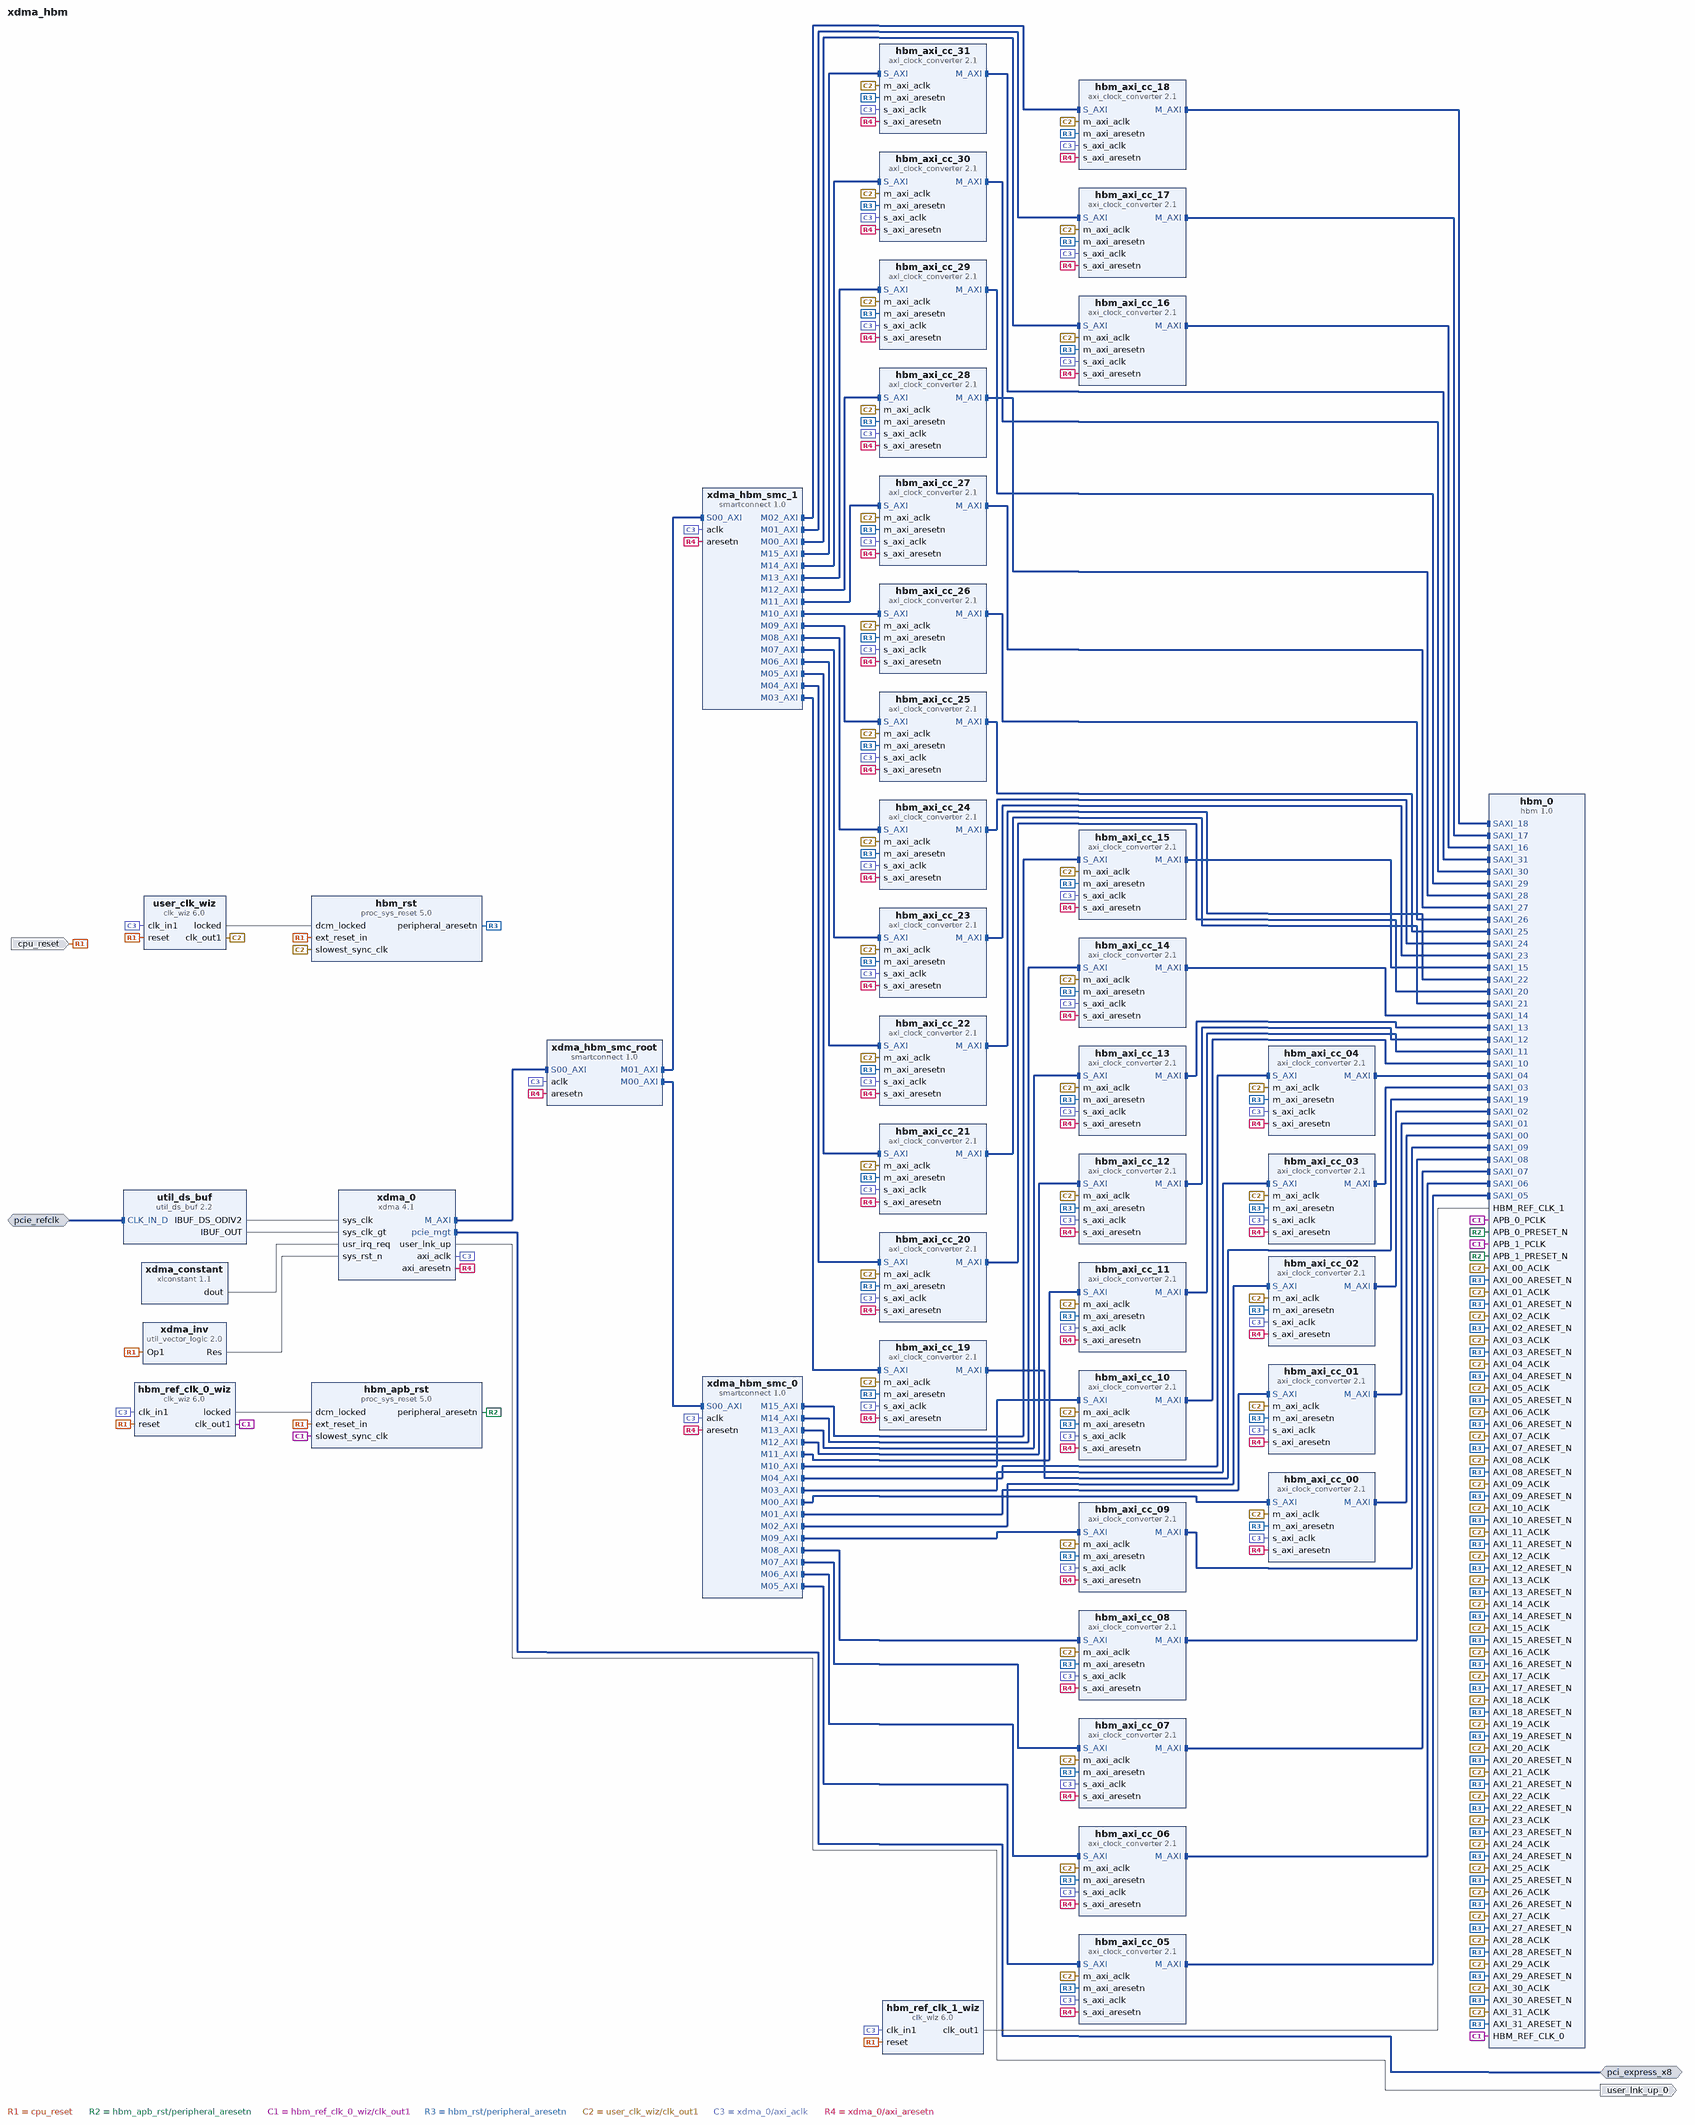
[diagram p0: block diagram of the top level]
# Vivado block design xdma_hbm, xcvu37p-fsvh2892-2L-e, Vivado 2024.2.2
create_bd_design xdma_hbm

create_bd_intf_port -mode Master -vlnv xilinx.com:interface:pcie_7x_mgt_rtl:1.0 pci_express_x8
create_bd_intf_port -mode Slave -vlnv xilinx.com:interface:diff_clock_rtl:1.0 pcie_refclk
set_property -dict {CONFIG.FREQ_HZ 100000000} [get_bd_intf_ports pcie_refclk]
create_bd_port -dir O user_lnk_up_0
create_bd_port -dir I -type rst cpu_reset
set_property -dict {CONFIG.POLARITY ACTIVE_HIGH} [get_bd_ports cpu_reset]

create_bd_cell -type ip -vlnv xilinx.com:ip:xdma:4.1 xdma_0
set_property -dict [list \
  CONFIG.PCIE_BOARD_INTERFACE pci_express_x8 \
  CONFIG.axi_data_width 256_bit \
  CONFIG.axilite_master_en false \
  CONFIG.axisten_freq 250 \
  CONFIG.cfg_mgmt_if false \
  CONFIG.en_ext_ch_gt_drp false \
  CONFIG.en_pcie_drp false \
  CONFIG.en_transceiver_status_ports false \
  CONFIG.enable_jtag_dbg false \
  CONFIG.mode_selection Advanced \
  CONFIG.pcie_extended_tag true \
  CONFIG.pf0_device_id 9024 \
  CONFIG.pf0_interrupt_pin NONE \
  CONFIG.pf0_msix_cap_pba_bir BAR_1:0 \
  CONFIG.pf0_msix_cap_pba_offset 00008FE0 \
  CONFIG.pf0_msix_cap_table_bir BAR_1:0 \
  CONFIG.pf0_msix_cap_table_offset 00008000 \
  CONFIG.pf0_msix_cap_table_size 01F \
  CONFIG.pf0_msix_enabled true \
  CONFIG.pipe_sim false \
  CONFIG.pl_link_cap_max_link_speed 8.0_GT/s \
  CONFIG.plltype QPLL1 \
  CONFIG.xdma_axi_intf_mm AXI_Memory_Mapped \
  CONFIG.xdma_pcie_64bit_en true \
  CONFIG.xdma_rnum_chnl 4 \
  CONFIG.xdma_wnum_chnl 4 \
] [get_bd_cells xdma_0]
create_bd_cell -type ip -vlnv xilinx.com:ip:xlconstant:1.1 xdma_constant
set_property -dict {CONFIG.CONST_VAL 0} [get_bd_cells xdma_constant]
create_bd_cell -type ip -vlnv xilinx.com:ip:util_vector_logic:2.0 xdma_inv
set_property -dict {CONFIG.C_OPERATION not CONFIG.C_SIZE 1} [get_bd_cells xdma_inv]
create_bd_cell -type ip -vlnv xilinx.com:ip:hbm:1.0 hbm_0
set_property -dict [list \
  CONFIG.USER_APB_EN false \
  CONFIG.USER_AXI_CLK1_FREQ 450 \
  CONFIG.USER_AXI_CLK_FREQ 450 \
  CONFIG.USER_HBM_DENSITY 8GB \
  CONFIG.USER_HBM_STACK 2 \
  CONFIG.USER_MC_ENABLE_00 TRUE \
  CONFIG.USER_MC_ENABLE_01 TRUE \
  CONFIG.USER_MC_ENABLE_02 TRUE \
  CONFIG.USER_MC_ENABLE_03 TRUE \
  CONFIG.USER_MC_ENABLE_04 TRUE \
  CONFIG.USER_MC_ENABLE_05 TRUE \
  CONFIG.USER_MC_ENABLE_06 TRUE \
  CONFIG.USER_MC_ENABLE_07 TRUE \
  CONFIG.USER_MC_ENABLE_08 TRUE \
  CONFIG.USER_MC_ENABLE_09 TRUE \
  CONFIG.USER_MC_ENABLE_10 TRUE \
  CONFIG.USER_MC_ENABLE_11 TRUE \
  CONFIG.USER_MC_ENABLE_12 TRUE \
  CONFIG.USER_MC_ENABLE_13 TRUE \
  CONFIG.USER_MC_ENABLE_14 TRUE \
  CONFIG.USER_MC_ENABLE_15 TRUE \
  CONFIG.USER_MC_ENABLE_APB_00 FALSE \
  CONFIG.USER_MC_ENABLE_APB_01 FALSE \
  CONFIG.USER_PHY_ENABLE_00 TRUE \
  CONFIG.USER_PHY_ENABLE_01 TRUE \
  CONFIG.USER_PHY_ENABLE_02 TRUE \
  CONFIG.USER_PHY_ENABLE_03 TRUE \
  CONFIG.USER_PHY_ENABLE_04 TRUE \
  CONFIG.USER_PHY_ENABLE_05 TRUE \
  CONFIG.USER_PHY_ENABLE_06 TRUE \
  CONFIG.USER_PHY_ENABLE_07 TRUE \
  CONFIG.USER_PHY_ENABLE_08 TRUE \
  CONFIG.USER_PHY_ENABLE_09 TRUE \
  CONFIG.USER_PHY_ENABLE_10 TRUE \
  CONFIG.USER_PHY_ENABLE_11 TRUE \
  CONFIG.USER_PHY_ENABLE_12 TRUE \
  CONFIG.USER_PHY_ENABLE_13 TRUE \
  CONFIG.USER_PHY_ENABLE_14 TRUE \
  CONFIG.USER_PHY_ENABLE_15 TRUE \
  CONFIG.USER_SAXI_00 true \
  CONFIG.USER_SAXI_01 true \
  CONFIG.USER_SAXI_02 true \
  CONFIG.USER_SAXI_03 true \
  CONFIG.USER_SAXI_04 true \
  CONFIG.USER_SAXI_05 true \
  CONFIG.USER_SAXI_06 true \
  CONFIG.USER_SAXI_07 true \
  CONFIG.USER_SAXI_08 true \
  CONFIG.USER_SAXI_09 true \
  CONFIG.USER_SAXI_10 true \
  CONFIG.USER_SAXI_11 true \
  CONFIG.USER_SAXI_12 true \
  CONFIG.USER_SAXI_13 true \
  CONFIG.USER_SAXI_14 true \
  CONFIG.USER_SAXI_15 true \
  CONFIG.USER_SAXI_16 true \
  CONFIG.USER_SAXI_17 true \
  CONFIG.USER_SAXI_18 true \
  CONFIG.USER_SAXI_19 true \
  CONFIG.USER_SAXI_20 true \
  CONFIG.USER_SAXI_21 true \
  CONFIG.USER_SAXI_22 true \
  CONFIG.USER_SAXI_23 true \
  CONFIG.USER_SAXI_24 true \
  CONFIG.USER_SAXI_25 true \
  CONFIG.USER_SAXI_26 true \
  CONFIG.USER_SAXI_27 true \
  CONFIG.USER_SAXI_28 true \
  CONFIG.USER_SAXI_29 true \
  CONFIG.USER_SAXI_30 true \
  CONFIG.USER_SAXI_31 true \
  CONFIG.USER_SWITCH_ENABLE_00 FALSE \
  CONFIG.USER_SWITCH_ENABLE_01 FALSE \
] [get_bd_cells hbm_0]
create_bd_cell -type ip -vlnv xilinx.com:ip:clk_wiz:6.0 hbm_ref_clk_0_wiz
set_property -dict [list \
  CONFIG.CLKOUT1_REQUESTED_OUT_FREQ 100.000 \
  CONFIG.OPTIMIZE_CLOCKING_STRUCTURE_EN true \
  CONFIG.PRIM_IN_FREQ 250.000 \
  CONFIG.RESET_TYPE ACTIVE_HIGH \
] [get_bd_cells hbm_ref_clk_0_wiz]
create_bd_cell -type ip -vlnv xilinx.com:ip:clk_wiz:6.0 hbm_ref_clk_1_wiz
set_property -dict [list \
  CONFIG.CLKOUT1_REQUESTED_OUT_FREQ 100.000 \
  CONFIG.OPTIMIZE_CLOCKING_STRUCTURE_EN true \
  CONFIG.PRIM_IN_FREQ 250.000 \
  CONFIG.RESET_TYPE ACTIVE_HIGH \
] [get_bd_cells hbm_ref_clk_1_wiz]
create_bd_cell -type ip -vlnv xilinx.com:ip:clk_wiz:6.0 user_clk_wiz
set_property -dict [list \
  CONFIG.CLKOUT1_REQUESTED_OUT_FREQ 450.000 \
  CONFIG.OPTIMIZE_CLOCKING_STRUCTURE_EN true \
  CONFIG.PRIM_IN_FREQ 250.000 \
  CONFIG.RESET_TYPE ACTIVE_HIGH \
] [get_bd_cells user_clk_wiz]
create_bd_cell -type ip -vlnv xilinx.com:ip:proc_sys_reset:5.0 hbm_rst
create_bd_cell -type ip -vlnv xilinx.com:ip:proc_sys_reset:5.0 hbm_apb_rst
create_bd_cell -type ip -vlnv xilinx.com:ip:axi_clock_converter:2.1 hbm_axi_cc_00
create_bd_cell -type ip -vlnv xilinx.com:ip:axi_clock_converter:2.1 hbm_axi_cc_01
create_bd_cell -type ip -vlnv xilinx.com:ip:axi_clock_converter:2.1 hbm_axi_cc_02
create_bd_cell -type ip -vlnv xilinx.com:ip:axi_clock_converter:2.1 hbm_axi_cc_03
create_bd_cell -type ip -vlnv xilinx.com:ip:axi_clock_converter:2.1 hbm_axi_cc_04
create_bd_cell -type ip -vlnv xilinx.com:ip:axi_clock_converter:2.1 hbm_axi_cc_05
create_bd_cell -type ip -vlnv xilinx.com:ip:axi_clock_converter:2.1 hbm_axi_cc_06
create_bd_cell -type ip -vlnv xilinx.com:ip:axi_clock_converter:2.1 hbm_axi_cc_07
create_bd_cell -type ip -vlnv xilinx.com:ip:axi_clock_converter:2.1 hbm_axi_cc_08
create_bd_cell -type ip -vlnv xilinx.com:ip:axi_clock_converter:2.1 hbm_axi_cc_09
create_bd_cell -type ip -vlnv xilinx.com:ip:axi_clock_converter:2.1 hbm_axi_cc_10
create_bd_cell -type ip -vlnv xilinx.com:ip:axi_clock_converter:2.1 hbm_axi_cc_11
create_bd_cell -type ip -vlnv xilinx.com:ip:axi_clock_converter:2.1 hbm_axi_cc_12
create_bd_cell -type ip -vlnv xilinx.com:ip:axi_clock_converter:2.1 hbm_axi_cc_13
create_bd_cell -type ip -vlnv xilinx.com:ip:axi_clock_converter:2.1 hbm_axi_cc_14
create_bd_cell -type ip -vlnv xilinx.com:ip:axi_clock_converter:2.1 hbm_axi_cc_15
create_bd_cell -type ip -vlnv xilinx.com:ip:axi_clock_converter:2.1 hbm_axi_cc_16
create_bd_cell -type ip -vlnv xilinx.com:ip:axi_clock_converter:2.1 hbm_axi_cc_17
create_bd_cell -type ip -vlnv xilinx.com:ip:axi_clock_converter:2.1 hbm_axi_cc_18
create_bd_cell -type ip -vlnv xilinx.com:ip:axi_clock_converter:2.1 hbm_axi_cc_19
create_bd_cell -type ip -vlnv xilinx.com:ip:axi_clock_converter:2.1 hbm_axi_cc_20
create_bd_cell -type ip -vlnv xilinx.com:ip:axi_clock_converter:2.1 hbm_axi_cc_21
create_bd_cell -type ip -vlnv xilinx.com:ip:axi_clock_converter:2.1 hbm_axi_cc_22
create_bd_cell -type ip -vlnv xilinx.com:ip:axi_clock_converter:2.1 hbm_axi_cc_23
create_bd_cell -type ip -vlnv xilinx.com:ip:axi_clock_converter:2.1 hbm_axi_cc_24
create_bd_cell -type ip -vlnv xilinx.com:ip:axi_clock_converter:2.1 hbm_axi_cc_25
create_bd_cell -type ip -vlnv xilinx.com:ip:axi_clock_converter:2.1 hbm_axi_cc_26
create_bd_cell -type ip -vlnv xilinx.com:ip:axi_clock_converter:2.1 hbm_axi_cc_27
create_bd_cell -type ip -vlnv xilinx.com:ip:axi_clock_converter:2.1 hbm_axi_cc_28
create_bd_cell -type ip -vlnv xilinx.com:ip:axi_clock_converter:2.1 hbm_axi_cc_29
create_bd_cell -type ip -vlnv xilinx.com:ip:axi_clock_converter:2.1 hbm_axi_cc_30
create_bd_cell -type ip -vlnv xilinx.com:ip:axi_clock_converter:2.1 hbm_axi_cc_31
create_bd_cell -type ip -vlnv xilinx.com:ip:smartconnect:1.0 xdma_hbm_smc_root
set_property -dict {CONFIG.NUM_MI 2 CONFIG.NUM_SI 1} [get_bd_cells xdma_hbm_smc_root]
create_bd_cell -type ip -vlnv xilinx.com:ip:smartconnect:1.0 xdma_hbm_smc_0
set_property -dict {CONFIG.NUM_MI 16 CONFIG.NUM_SI 1} [get_bd_cells xdma_hbm_smc_0]
create_bd_cell -type ip -vlnv xilinx.com:ip:smartconnect:1.0 xdma_hbm_smc_1
set_property -dict {CONFIG.NUM_MI 16 CONFIG.NUM_SI 1} [get_bd_cells xdma_hbm_smc_1]
create_bd_cell -type ip -vlnv xilinx.com:ip:util_ds_buf:2.2 util_ds_buf
set_property -dict {CONFIG.DIFF_CLK_IN_BOARD_INTERFACE pcie_refclk CONFIG.USE_BOARD_FLOW true} [get_bd_cells util_ds_buf]

# ---- connections ----

connect_bd_intf_net [get_bd_intf_pins hbm_axi_cc_00/M_AXI] [get_bd_intf_pins hbm_0/SAXI_00]
connect_bd_intf_net [get_bd_intf_pins hbm_axi_cc_01/M_AXI] [get_bd_intf_pins hbm_0/SAXI_01]
connect_bd_intf_net [get_bd_intf_pins hbm_axi_cc_02/M_AXI] [get_bd_intf_pins hbm_0/SAXI_02]
connect_bd_intf_net [get_bd_intf_pins hbm_axi_cc_03/M_AXI] [get_bd_intf_pins hbm_0/SAXI_03]
connect_bd_intf_net [get_bd_intf_pins hbm_axi_cc_04/M_AXI] [get_bd_intf_pins hbm_0/SAXI_04]
connect_bd_intf_net [get_bd_intf_pins hbm_axi_cc_05/M_AXI] [get_bd_intf_pins hbm_0/SAXI_05]
connect_bd_intf_net [get_bd_intf_pins hbm_axi_cc_06/M_AXI] [get_bd_intf_pins hbm_0/SAXI_06]
connect_bd_intf_net [get_bd_intf_pins hbm_axi_cc_07/M_AXI] [get_bd_intf_pins hbm_0/SAXI_07]
connect_bd_intf_net [get_bd_intf_pins hbm_axi_cc_08/M_AXI] [get_bd_intf_pins hbm_0/SAXI_08]
connect_bd_intf_net [get_bd_intf_pins hbm_axi_cc_09/M_AXI] [get_bd_intf_pins hbm_0/SAXI_09]
connect_bd_intf_net [get_bd_intf_pins hbm_axi_cc_10/M_AXI] [get_bd_intf_pins hbm_0/SAXI_10]
connect_bd_intf_net [get_bd_intf_pins hbm_axi_cc_11/M_AXI] [get_bd_intf_pins hbm_0/SAXI_11]
connect_bd_intf_net [get_bd_intf_pins hbm_axi_cc_12/M_AXI] [get_bd_intf_pins hbm_0/SAXI_12]
connect_bd_intf_net [get_bd_intf_pins hbm_axi_cc_13/M_AXI] [get_bd_intf_pins hbm_0/SAXI_13]
connect_bd_intf_net [get_bd_intf_pins hbm_axi_cc_14/M_AXI] [get_bd_intf_pins hbm_0/SAXI_14]
connect_bd_intf_net [get_bd_intf_pins hbm_axi_cc_15/M_AXI] [get_bd_intf_pins hbm_0/SAXI_15]
connect_bd_intf_net [get_bd_intf_pins hbm_axi_cc_16/M_AXI] [get_bd_intf_pins hbm_0/SAXI_16]
connect_bd_intf_net [get_bd_intf_pins hbm_axi_cc_17/M_AXI] [get_bd_intf_pins hbm_0/SAXI_17]
connect_bd_intf_net [get_bd_intf_pins hbm_axi_cc_18/M_AXI] [get_bd_intf_pins hbm_0/SAXI_18]
connect_bd_intf_net [get_bd_intf_pins hbm_axi_cc_19/M_AXI] [get_bd_intf_pins hbm_0/SAXI_19]
connect_bd_intf_net [get_bd_intf_pins hbm_axi_cc_20/M_AXI] [get_bd_intf_pins hbm_0/SAXI_20]
connect_bd_intf_net [get_bd_intf_pins hbm_axi_cc_21/M_AXI] [get_bd_intf_pins hbm_0/SAXI_21]
connect_bd_intf_net [get_bd_intf_pins hbm_axi_cc_22/M_AXI] [get_bd_intf_pins hbm_0/SAXI_22]
connect_bd_intf_net [get_bd_intf_pins hbm_axi_cc_23/M_AXI] [get_bd_intf_pins hbm_0/SAXI_23]
connect_bd_intf_net [get_bd_intf_pins hbm_axi_cc_24/M_AXI] [get_bd_intf_pins hbm_0/SAXI_24]
connect_bd_intf_net [get_bd_intf_pins hbm_axi_cc_25/M_AXI] [get_bd_intf_pins hbm_0/SAXI_25]
connect_bd_intf_net [get_bd_intf_pins hbm_axi_cc_26/M_AXI] [get_bd_intf_pins hbm_0/SAXI_26]
connect_bd_intf_net [get_bd_intf_pins hbm_axi_cc_27/M_AXI] [get_bd_intf_pins hbm_0/SAXI_27]
connect_bd_intf_net [get_bd_intf_pins hbm_axi_cc_28/M_AXI] [get_bd_intf_pins hbm_0/SAXI_28]
connect_bd_intf_net [get_bd_intf_pins hbm_axi_cc_29/M_AXI] [get_bd_intf_pins hbm_0/SAXI_29]
connect_bd_intf_net [get_bd_intf_pins hbm_axi_cc_30/M_AXI] [get_bd_intf_pins hbm_0/SAXI_30]
connect_bd_intf_net [get_bd_intf_pins hbm_axi_cc_31/M_AXI] [get_bd_intf_pins hbm_0/SAXI_31]
connect_bd_intf_net [get_bd_intf_ports pcie_refclk] [get_bd_intf_pins util_ds_buf/CLK_IN_D]
connect_bd_intf_net [get_bd_intf_pins xdma_0/M_AXI] [get_bd_intf_pins xdma_hbm_smc_root/S00_AXI]
connect_bd_intf_net [get_bd_intf_ports pci_express_x8] [get_bd_intf_pins xdma_0/pcie_mgt]
connect_bd_intf_net [get_bd_intf_pins xdma_hbm_smc_0/M00_AXI] [get_bd_intf_pins hbm_axi_cc_00/S_AXI]
connect_bd_intf_net [get_bd_intf_pins xdma_hbm_smc_0/M01_AXI] [get_bd_intf_pins hbm_axi_cc_01/S_AXI]
connect_bd_intf_net [get_bd_intf_pins xdma_hbm_smc_0/M02_AXI] [get_bd_intf_pins hbm_axi_cc_02/S_AXI]
connect_bd_intf_net [get_bd_intf_pins xdma_hbm_smc_0/M03_AXI] [get_bd_intf_pins hbm_axi_cc_03/S_AXI]
connect_bd_intf_net [get_bd_intf_pins xdma_hbm_smc_0/M04_AXI] [get_bd_intf_pins hbm_axi_cc_04/S_AXI]
connect_bd_intf_net [get_bd_intf_pins xdma_hbm_smc_0/M05_AXI] [get_bd_intf_pins hbm_axi_cc_05/S_AXI]
connect_bd_intf_net [get_bd_intf_pins xdma_hbm_smc_0/M06_AXI] [get_bd_intf_pins hbm_axi_cc_06/S_AXI]
connect_bd_intf_net [get_bd_intf_pins xdma_hbm_smc_0/M07_AXI] [get_bd_intf_pins hbm_axi_cc_07/S_AXI]
connect_bd_intf_net [get_bd_intf_pins xdma_hbm_smc_0/M08_AXI] [get_bd_intf_pins hbm_axi_cc_08/S_AXI]
connect_bd_intf_net [get_bd_intf_pins xdma_hbm_smc_0/M09_AXI] [get_bd_intf_pins hbm_axi_cc_09/S_AXI]
connect_bd_intf_net [get_bd_intf_pins xdma_hbm_smc_0/M10_AXI] [get_bd_intf_pins hbm_axi_cc_10/S_AXI]
connect_bd_intf_net [get_bd_intf_pins xdma_hbm_smc_0/M11_AXI] [get_bd_intf_pins hbm_axi_cc_11/S_AXI]
connect_bd_intf_net [get_bd_intf_pins xdma_hbm_smc_0/M12_AXI] [get_bd_intf_pins hbm_axi_cc_12/S_AXI]
connect_bd_intf_net [get_bd_intf_pins xdma_hbm_smc_0/M13_AXI] [get_bd_intf_pins hbm_axi_cc_13/S_AXI]
connect_bd_intf_net [get_bd_intf_pins xdma_hbm_smc_0/M14_AXI] [get_bd_intf_pins hbm_axi_cc_14/S_AXI]
connect_bd_intf_net [get_bd_intf_pins xdma_hbm_smc_0/M15_AXI] [get_bd_intf_pins hbm_axi_cc_15/S_AXI]
connect_bd_intf_net [get_bd_intf_pins xdma_hbm_smc_1/M00_AXI] [get_bd_intf_pins hbm_axi_cc_16/S_AXI]
connect_bd_intf_net [get_bd_intf_pins xdma_hbm_smc_1/M01_AXI] [get_bd_intf_pins hbm_axi_cc_17/S_AXI]
connect_bd_intf_net [get_bd_intf_pins xdma_hbm_smc_1/M02_AXI] [get_bd_intf_pins hbm_axi_cc_18/S_AXI]
connect_bd_intf_net [get_bd_intf_pins xdma_hbm_smc_1/M03_AXI] [get_bd_intf_pins hbm_axi_cc_19/S_AXI]
connect_bd_intf_net [get_bd_intf_pins xdma_hbm_smc_1/M04_AXI] [get_bd_intf_pins hbm_axi_cc_20/S_AXI]
connect_bd_intf_net [get_bd_intf_pins xdma_hbm_smc_1/M05_AXI] [get_bd_intf_pins hbm_axi_cc_21/S_AXI]
connect_bd_intf_net [get_bd_intf_pins xdma_hbm_smc_1/M06_AXI] [get_bd_intf_pins hbm_axi_cc_22/S_AXI]
connect_bd_intf_net [get_bd_intf_pins xdma_hbm_smc_1/M07_AXI] [get_bd_intf_pins hbm_axi_cc_23/S_AXI]
connect_bd_intf_net [get_bd_intf_pins xdma_hbm_smc_1/M08_AXI] [get_bd_intf_pins hbm_axi_cc_24/S_AXI]
connect_bd_intf_net [get_bd_intf_pins xdma_hbm_smc_1/M09_AXI] [get_bd_intf_pins hbm_axi_cc_25/S_AXI]
connect_bd_intf_net [get_bd_intf_pins xdma_hbm_smc_1/M10_AXI] [get_bd_intf_pins hbm_axi_cc_26/S_AXI]
connect_bd_intf_net [get_bd_intf_pins xdma_hbm_smc_1/M11_AXI] [get_bd_intf_pins hbm_axi_cc_27/S_AXI]
connect_bd_intf_net [get_bd_intf_pins xdma_hbm_smc_1/M12_AXI] [get_bd_intf_pins hbm_axi_cc_28/S_AXI]
connect_bd_intf_net [get_bd_intf_pins xdma_hbm_smc_1/M13_AXI] [get_bd_intf_pins hbm_axi_cc_29/S_AXI]
connect_bd_intf_net [get_bd_intf_pins xdma_hbm_smc_1/M14_AXI] [get_bd_intf_pins hbm_axi_cc_30/S_AXI]
connect_bd_intf_net [get_bd_intf_pins xdma_hbm_smc_1/M15_AXI] [get_bd_intf_pins hbm_axi_cc_31/S_AXI]
connect_bd_intf_net [get_bd_intf_pins xdma_hbm_smc_root/M00_AXI] [get_bd_intf_pins xdma_hbm_smc_0/S00_AXI]
connect_bd_intf_net [get_bd_intf_pins xdma_hbm_smc_root/M01_AXI] [get_bd_intf_pins xdma_hbm_smc_1/S00_AXI]
connect_bd_net [get_bd_ports cpu_reset] \
  [get_bd_pins xdma_inv/Op1] [get_bd_pins hbm_ref_clk_0_wiz/reset] [get_bd_pins hbm_ref_clk_1_wiz/reset] \
  [get_bd_pins user_clk_wiz/reset] [get_bd_pins hbm_rst/ext_reset_in] [get_bd_pins hbm_apb_rst/ext_reset_in]
connect_bd_net [get_bd_pins hbm_apb_rst/peripheral_aresetn] [get_bd_pins hbm_0/APB_0_PRESET_N] [get_bd_pins hbm_0/APB_1_PRESET_N]
connect_bd_net [get_bd_pins hbm_ref_clk_0_wiz/clk_out1] \
  [get_bd_pins hbm_apb_rst/slowest_sync_clk] [get_bd_pins hbm_0/HBM_REF_CLK_0] [get_bd_pins hbm_0/APB_0_PCLK] \
  [get_bd_pins hbm_0/APB_1_PCLK]
connect_bd_net [get_bd_pins hbm_ref_clk_0_wiz/locked] [get_bd_pins hbm_apb_rst/dcm_locked]
connect_bd_net [get_bd_pins hbm_ref_clk_1_wiz/clk_out1] [get_bd_pins hbm_0/HBM_REF_CLK_1]
connect_bd_net [get_bd_pins hbm_rst/peripheral_aresetn] \
  [get_bd_pins hbm_axi_cc_00/m_axi_aresetn] [get_bd_pins hbm_0/AXI_00_ARESET_N] [get_bd_pins hbm_axi_cc_01/m_axi_aresetn] \
  [get_bd_pins hbm_0/AXI_01_ARESET_N] [get_bd_pins hbm_axi_cc_02/m_axi_aresetn] [get_bd_pins hbm_0/AXI_02_ARESET_N] \
  [get_bd_pins hbm_axi_cc_03/m_axi_aresetn] [get_bd_pins hbm_0/AXI_03_ARESET_N] [get_bd_pins hbm_axi_cc_04/m_axi_aresetn] \
  [get_bd_pins hbm_0/AXI_04_ARESET_N] [get_bd_pins hbm_axi_cc_05/m_axi_aresetn] [get_bd_pins hbm_0/AXI_05_ARESET_N] \
  [get_bd_pins hbm_axi_cc_06/m_axi_aresetn] [get_bd_pins hbm_0/AXI_06_ARESET_N] [get_bd_pins hbm_axi_cc_07/m_axi_aresetn] \
  [get_bd_pins hbm_0/AXI_07_ARESET_N] [get_bd_pins hbm_axi_cc_08/m_axi_aresetn] [get_bd_pins hbm_0/AXI_08_ARESET_N] \
  [get_bd_pins hbm_axi_cc_09/m_axi_aresetn] [get_bd_pins hbm_0/AXI_09_ARESET_N] [get_bd_pins hbm_axi_cc_10/m_axi_aresetn] \
  [get_bd_pins hbm_0/AXI_10_ARESET_N] [get_bd_pins hbm_axi_cc_11/m_axi_aresetn] [get_bd_pins hbm_0/AXI_11_ARESET_N] \
  [get_bd_pins hbm_axi_cc_12/m_axi_aresetn] [get_bd_pins hbm_0/AXI_12_ARESET_N] [get_bd_pins hbm_axi_cc_13/m_axi_aresetn] \
  [get_bd_pins hbm_0/AXI_13_ARESET_N] [get_bd_pins hbm_axi_cc_14/m_axi_aresetn] [get_bd_pins hbm_0/AXI_14_ARESET_N] \
  [get_bd_pins hbm_axi_cc_15/m_axi_aresetn] [get_bd_pins hbm_0/AXI_15_ARESET_N] [get_bd_pins hbm_axi_cc_16/m_axi_aresetn] \
  [get_bd_pins hbm_0/AXI_16_ARESET_N] [get_bd_pins hbm_axi_cc_17/m_axi_aresetn] [get_bd_pins hbm_0/AXI_17_ARESET_N] \
  [get_bd_pins hbm_axi_cc_18/m_axi_aresetn] [get_bd_pins hbm_0/AXI_18_ARESET_N] [get_bd_pins hbm_axi_cc_19/m_axi_aresetn] \
  [get_bd_pins hbm_0/AXI_19_ARESET_N] [get_bd_pins hbm_axi_cc_20/m_axi_aresetn] [get_bd_pins hbm_0/AXI_20_ARESET_N] \
  [get_bd_pins hbm_axi_cc_21/m_axi_aresetn] [get_bd_pins hbm_0/AXI_21_ARESET_N] [get_bd_pins hbm_axi_cc_22/m_axi_aresetn] \
  [get_bd_pins hbm_0/AXI_22_ARESET_N] [get_bd_pins hbm_axi_cc_23/m_axi_aresetn] [get_bd_pins hbm_0/AXI_23_ARESET_N] \
  [get_bd_pins hbm_axi_cc_24/m_axi_aresetn] [get_bd_pins hbm_0/AXI_24_ARESET_N] [get_bd_pins hbm_axi_cc_25/m_axi_aresetn] \
  [get_bd_pins hbm_0/AXI_25_ARESET_N] [get_bd_pins hbm_axi_cc_26/m_axi_aresetn] [get_bd_pins hbm_0/AXI_26_ARESET_N] \
  [get_bd_pins hbm_axi_cc_27/m_axi_aresetn] [get_bd_pins hbm_0/AXI_27_ARESET_N] [get_bd_pins hbm_axi_cc_28/m_axi_aresetn] \
  [get_bd_pins hbm_0/AXI_28_ARESET_N] [get_bd_pins hbm_axi_cc_29/m_axi_aresetn] [get_bd_pins hbm_0/AXI_29_ARESET_N] \
  [get_bd_pins hbm_axi_cc_30/m_axi_aresetn] [get_bd_pins hbm_0/AXI_30_ARESET_N] [get_bd_pins hbm_axi_cc_31/m_axi_aresetn] \
  [get_bd_pins hbm_0/AXI_31_ARESET_N]
connect_bd_net [get_bd_pins user_clk_wiz/clk_out1] \
  [get_bd_pins hbm_rst/slowest_sync_clk] [get_bd_pins hbm_axi_cc_00/m_axi_aclk] [get_bd_pins hbm_0/AXI_00_ACLK] \
  [get_bd_pins hbm_axi_cc_01/m_axi_aclk] [get_bd_pins hbm_0/AXI_01_ACLK] [get_bd_pins hbm_axi_cc_02/m_axi_aclk] \
  [get_bd_pins hbm_0/AXI_02_ACLK] [get_bd_pins hbm_axi_cc_03/m_axi_aclk] [get_bd_pins hbm_0/AXI_03_ACLK] \
  [get_bd_pins hbm_axi_cc_04/m_axi_aclk] [get_bd_pins hbm_0/AXI_04_ACLK] [get_bd_pins hbm_axi_cc_05/m_axi_aclk] \
  [get_bd_pins hbm_0/AXI_05_ACLK] [get_bd_pins hbm_axi_cc_06/m_axi_aclk] [get_bd_pins hbm_0/AXI_06_ACLK] \
  [get_bd_pins hbm_axi_cc_07/m_axi_aclk] [get_bd_pins hbm_0/AXI_07_ACLK] [get_bd_pins hbm_axi_cc_08/m_axi_aclk] \
  [get_bd_pins hbm_0/AXI_08_ACLK] [get_bd_pins hbm_axi_cc_09/m_axi_aclk] [get_bd_pins hbm_0/AXI_09_ACLK] \
  [get_bd_pins hbm_axi_cc_10/m_axi_aclk] [get_bd_pins hbm_0/AXI_10_ACLK] [get_bd_pins hbm_axi_cc_11/m_axi_aclk] \
  [get_bd_pins hbm_0/AXI_11_ACLK] [get_bd_pins hbm_axi_cc_12/m_axi_aclk] [get_bd_pins hbm_0/AXI_12_ACLK] \
  [get_bd_pins hbm_axi_cc_13/m_axi_aclk] [get_bd_pins hbm_0/AXI_13_ACLK] [get_bd_pins hbm_axi_cc_14/m_axi_aclk] \
  [get_bd_pins hbm_0/AXI_14_ACLK] [get_bd_pins hbm_axi_cc_15/m_axi_aclk] [get_bd_pins hbm_0/AXI_15_ACLK] \
  [get_bd_pins hbm_axi_cc_16/m_axi_aclk] [get_bd_pins hbm_0/AXI_16_ACLK] [get_bd_pins hbm_axi_cc_17/m_axi_aclk] \
  [get_bd_pins hbm_0/AXI_17_ACLK] [get_bd_pins hbm_axi_cc_18/m_axi_aclk] [get_bd_pins hbm_0/AXI_18_ACLK] \
  [get_bd_pins hbm_axi_cc_19/m_axi_aclk] [get_bd_pins hbm_0/AXI_19_ACLK] [get_bd_pins hbm_axi_cc_20/m_axi_aclk] \
  [get_bd_pins hbm_0/AXI_20_ACLK] [get_bd_pins hbm_axi_cc_21/m_axi_aclk] [get_bd_pins hbm_0/AXI_21_ACLK] \
  [get_bd_pins hbm_axi_cc_22/m_axi_aclk] [get_bd_pins hbm_0/AXI_22_ACLK] [get_bd_pins hbm_axi_cc_23/m_axi_aclk] \
  [get_bd_pins hbm_0/AXI_23_ACLK] [get_bd_pins hbm_axi_cc_24/m_axi_aclk] [get_bd_pins hbm_0/AXI_24_ACLK] \
  [get_bd_pins hbm_axi_cc_25/m_axi_aclk] [get_bd_pins hbm_0/AXI_25_ACLK] [get_bd_pins hbm_axi_cc_26/m_axi_aclk] \
  [get_bd_pins hbm_0/AXI_26_ACLK] [get_bd_pins hbm_axi_cc_27/m_axi_aclk] [get_bd_pins hbm_0/AXI_27_ACLK] \
  [get_bd_pins hbm_axi_cc_28/m_axi_aclk] [get_bd_pins hbm_0/AXI_28_ACLK] [get_bd_pins hbm_axi_cc_29/m_axi_aclk] \
  [get_bd_pins hbm_0/AXI_29_ACLK] [get_bd_pins hbm_axi_cc_30/m_axi_aclk] [get_bd_pins hbm_0/AXI_30_ACLK] \
  [get_bd_pins hbm_axi_cc_31/m_axi_aclk] [get_bd_pins hbm_0/AXI_31_ACLK]
connect_bd_net [get_bd_pins user_clk_wiz/locked] [get_bd_pins hbm_rst/dcm_locked]
connect_bd_net [get_bd_pins util_ds_buf/IBUF_DS_ODIV2] [get_bd_pins xdma_0/sys_clk]
connect_bd_net [get_bd_pins util_ds_buf/IBUF_OUT] [get_bd_pins xdma_0/sys_clk_gt]
connect_bd_net [get_bd_pins xdma_0/axi_aclk] \
  [get_bd_pins hbm_ref_clk_0_wiz/clk_in1] [get_bd_pins hbm_ref_clk_1_wiz/clk_in1] [get_bd_pins user_clk_wiz/clk_in1] \
  [get_bd_pins xdma_hbm_smc_root/aclk] [get_bd_pins xdma_hbm_smc_0/aclk] [get_bd_pins xdma_hbm_smc_1/aclk] \
  [get_bd_pins hbm_axi_cc_00/s_axi_aclk] [get_bd_pins hbm_axi_cc_01/s_axi_aclk] [get_bd_pins hbm_axi_cc_02/s_axi_aclk] \
  [get_bd_pins hbm_axi_cc_03/s_axi_aclk] [get_bd_pins hbm_axi_cc_04/s_axi_aclk] [get_bd_pins hbm_axi_cc_05/s_axi_aclk] \
  [get_bd_pins hbm_axi_cc_06/s_axi_aclk] [get_bd_pins hbm_axi_cc_07/s_axi_aclk] [get_bd_pins hbm_axi_cc_08/s_axi_aclk] \
  [get_bd_pins hbm_axi_cc_09/s_axi_aclk] [get_bd_pins hbm_axi_cc_10/s_axi_aclk] [get_bd_pins hbm_axi_cc_11/s_axi_aclk] \
  [get_bd_pins hbm_axi_cc_12/s_axi_aclk] [get_bd_pins hbm_axi_cc_13/s_axi_aclk] [get_bd_pins hbm_axi_cc_14/s_axi_aclk] \
  [get_bd_pins hbm_axi_cc_15/s_axi_aclk] [get_bd_pins hbm_axi_cc_16/s_axi_aclk] [get_bd_pins hbm_axi_cc_17/s_axi_aclk] \
  [get_bd_pins hbm_axi_cc_18/s_axi_aclk] [get_bd_pins hbm_axi_cc_19/s_axi_aclk] [get_bd_pins hbm_axi_cc_20/s_axi_aclk] \
  [get_bd_pins hbm_axi_cc_21/s_axi_aclk] [get_bd_pins hbm_axi_cc_22/s_axi_aclk] [get_bd_pins hbm_axi_cc_23/s_axi_aclk] \
  [get_bd_pins hbm_axi_cc_24/s_axi_aclk] [get_bd_pins hbm_axi_cc_25/s_axi_aclk] [get_bd_pins hbm_axi_cc_26/s_axi_aclk] \
  [get_bd_pins hbm_axi_cc_27/s_axi_aclk] [get_bd_pins hbm_axi_cc_28/s_axi_aclk] [get_bd_pins hbm_axi_cc_29/s_axi_aclk] \
  [get_bd_pins hbm_axi_cc_30/s_axi_aclk] [get_bd_pins hbm_axi_cc_31/s_axi_aclk]
connect_bd_net [get_bd_pins xdma_0/axi_aresetn] \
  [get_bd_pins xdma_hbm_smc_root/aresetn] [get_bd_pins xdma_hbm_smc_0/aresetn] [get_bd_pins xdma_hbm_smc_1/aresetn] \
  [get_bd_pins hbm_axi_cc_00/s_axi_aresetn] [get_bd_pins hbm_axi_cc_01/s_axi_aresetn] \
  [get_bd_pins hbm_axi_cc_02/s_axi_aresetn] [get_bd_pins hbm_axi_cc_03/s_axi_aresetn] \
  [get_bd_pins hbm_axi_cc_04/s_axi_aresetn] [get_bd_pins hbm_axi_cc_05/s_axi_aresetn] \
  [get_bd_pins hbm_axi_cc_06/s_axi_aresetn] [get_bd_pins hbm_axi_cc_07/s_axi_aresetn] \
  [get_bd_pins hbm_axi_cc_08/s_axi_aresetn] [get_bd_pins hbm_axi_cc_09/s_axi_aresetn] \
  [get_bd_pins hbm_axi_cc_10/s_axi_aresetn] [get_bd_pins hbm_axi_cc_11/s_axi_aresetn] \
  [get_bd_pins hbm_axi_cc_12/s_axi_aresetn] [get_bd_pins hbm_axi_cc_13/s_axi_aresetn] \
  [get_bd_pins hbm_axi_cc_14/s_axi_aresetn] [get_bd_pins hbm_axi_cc_15/s_axi_aresetn] \
  [get_bd_pins hbm_axi_cc_16/s_axi_aresetn] [get_bd_pins hbm_axi_cc_17/s_axi_aresetn] \
  [get_bd_pins hbm_axi_cc_18/s_axi_aresetn] [get_bd_pins hbm_axi_cc_19/s_axi_aresetn] \
  [get_bd_pins hbm_axi_cc_20/s_axi_aresetn] [get_bd_pins hbm_axi_cc_21/s_axi_aresetn] \
  [get_bd_pins hbm_axi_cc_22/s_axi_aresetn] [get_bd_pins hbm_axi_cc_23/s_axi_aresetn] \
  [get_bd_pins hbm_axi_cc_24/s_axi_aresetn] [get_bd_pins hbm_axi_cc_25/s_axi_aresetn] \
  [get_bd_pins hbm_axi_cc_26/s_axi_aresetn] [get_bd_pins hbm_axi_cc_27/s_axi_aresetn] \
  [get_bd_pins hbm_axi_cc_28/s_axi_aresetn] [get_bd_pins hbm_axi_cc_29/s_axi_aresetn] \
  [get_bd_pins hbm_axi_cc_30/s_axi_aresetn] [get_bd_pins hbm_axi_cc_31/s_axi_aresetn]
connect_bd_net [get_bd_pins xdma_0/user_lnk_up] [get_bd_ports user_lnk_up_0]
connect_bd_net [get_bd_pins xdma_constant/dout] [get_bd_pins xdma_0/usr_irq_req]
connect_bd_net [get_bd_pins xdma_inv/Res] [get_bd_pins xdma_0/sys_rst_n]

# ---- address map ----
assign_bd_address -offset 0x0000000000000000 -range 256M -target_address_space [get_bd_addr_spaces xdma_0/M_AXI] [get_bd_addr_segs hbm_0/SAXI_00/HBM_MEM00]
assign_bd_address -offset 0x0000000010000000 -range 256M -target_address_space [get_bd_addr_spaces xdma_0/M_AXI] [get_bd_addr_segs hbm_0/SAXI_01/HBM_MEM01]
assign_bd_address -offset 0x0000000020000000 -range 256M -target_address_space [get_bd_addr_spaces xdma_0/M_AXI] [get_bd_addr_segs hbm_0/SAXI_02/HBM_MEM02]
assign_bd_address -offset 0x0000000030000000 -range 256M -target_address_space [get_bd_addr_spaces xdma_0/M_AXI] [get_bd_addr_segs hbm_0/SAXI_03/HBM_MEM03]
assign_bd_address -offset 0x0000000040000000 -range 256M -target_address_space [get_bd_addr_spaces xdma_0/M_AXI] [get_bd_addr_segs hbm_0/SAXI_04/HBM_MEM04]
assign_bd_address -offset 0x0000000050000000 -range 256M -target_address_space [get_bd_addr_spaces xdma_0/M_AXI] [get_bd_addr_segs hbm_0/SAXI_05/HBM_MEM05]
assign_bd_address -offset 0x0000000060000000 -range 256M -target_address_space [get_bd_addr_spaces xdma_0/M_AXI] [get_bd_addr_segs hbm_0/SAXI_06/HBM_MEM06]
assign_bd_address -offset 0x0000000070000000 -range 256M -target_address_space [get_bd_addr_spaces xdma_0/M_AXI] [get_bd_addr_segs hbm_0/SAXI_07/HBM_MEM07]
assign_bd_address -offset 0x0000000080000000 -range 256M -target_address_space [get_bd_addr_spaces xdma_0/M_AXI] [get_bd_addr_segs hbm_0/SAXI_08/HBM_MEM08]
assign_bd_address -offset 0x0000000090000000 -range 256M -target_address_space [get_bd_addr_spaces xdma_0/M_AXI] [get_bd_addr_segs hbm_0/SAXI_09/HBM_MEM09]
assign_bd_address -offset 0x00000000A0000000 -range 256M -target_address_space [get_bd_addr_spaces xdma_0/M_AXI] [get_bd_addr_segs hbm_0/SAXI_10/HBM_MEM10]
assign_bd_address -offset 0x00000000B0000000 -range 256M -target_address_space [get_bd_addr_spaces xdma_0/M_AXI] [get_bd_addr_segs hbm_0/SAXI_11/HBM_MEM11]
assign_bd_address -offset 0x00000000C0000000 -range 256M -target_address_space [get_bd_addr_spaces xdma_0/M_AXI] [get_bd_addr_segs hbm_0/SAXI_12/HBM_MEM12]
assign_bd_address -offset 0x00000000D0000000 -range 256M -target_address_space [get_bd_addr_spaces xdma_0/M_AXI] [get_bd_addr_segs hbm_0/SAXI_13/HBM_MEM13]
assign_bd_address -offset 0x00000000E0000000 -range 256M -target_address_space [get_bd_addr_spaces xdma_0/M_AXI] [get_bd_addr_segs hbm_0/SAXI_14/HBM_MEM14]
assign_bd_address -offset 0x00000000F0000000 -range 256M -target_address_space [get_bd_addr_spaces xdma_0/M_AXI] [get_bd_addr_segs hbm_0/SAXI_15/HBM_MEM15]
assign_bd_address -offset 0x0000000100000000 -range 256M -target_address_space [get_bd_addr_spaces xdma_0/M_AXI] [get_bd_addr_segs hbm_0/SAXI_16/HBM_MEM16]
assign_bd_address -offset 0x0000000110000000 -range 256M -target_address_space [get_bd_addr_spaces xdma_0/M_AXI] [get_bd_addr_segs hbm_0/SAXI_17/HBM_MEM17]
assign_bd_address -offset 0x0000000120000000 -range 256M -target_address_space [get_bd_addr_spaces xdma_0/M_AXI] [get_bd_addr_segs hbm_0/SAXI_18/HBM_MEM18]
assign_bd_address -offset 0x0000000130000000 -range 256M -target_address_space [get_bd_addr_spaces xdma_0/M_AXI] [get_bd_addr_segs hbm_0/SAXI_19/HBM_MEM19]
assign_bd_address -offset 0x0000000140000000 -range 256M -target_address_space [get_bd_addr_spaces xdma_0/M_AXI] [get_bd_addr_segs hbm_0/SAXI_20/HBM_MEM20]
assign_bd_address -offset 0x0000000150000000 -range 256M -target_address_space [get_bd_addr_spaces xdma_0/M_AXI] [get_bd_addr_segs hbm_0/SAXI_21/HBM_MEM21]
assign_bd_address -offset 0x0000000160000000 -range 256M -target_address_space [get_bd_addr_spaces xdma_0/M_AXI] [get_bd_addr_segs hbm_0/SAXI_22/HBM_MEM22]
assign_bd_address -offset 0x0000000170000000 -range 256M -target_address_space [get_bd_addr_spaces xdma_0/M_AXI] [get_bd_addr_segs hbm_0/SAXI_23/HBM_MEM23]
assign_bd_address -offset 0x0000000180000000 -range 256M -target_address_space [get_bd_addr_spaces xdma_0/M_AXI] [get_bd_addr_segs hbm_0/SAXI_24/HBM_MEM24]
assign_bd_address -offset 0x0000000190000000 -range 256M -target_address_space [get_bd_addr_spaces xdma_0/M_AXI] [get_bd_addr_segs hbm_0/SAXI_25/HBM_MEM25]
assign_bd_address -offset 0x00000001A0000000 -range 256M -target_address_space [get_bd_addr_spaces xdma_0/M_AXI] [get_bd_addr_segs hbm_0/SAXI_26/HBM_MEM26]
assign_bd_address -offset 0x00000001B0000000 -range 256M -target_address_space [get_bd_addr_spaces xdma_0/M_AXI] [get_bd_addr_segs hbm_0/SAXI_27/HBM_MEM27]
assign_bd_address -offset 0x00000001C0000000 -range 256M -target_address_space [get_bd_addr_spaces xdma_0/M_AXI] [get_bd_addr_segs hbm_0/SAXI_28/HBM_MEM28]
assign_bd_address -offset 0x00000001D0000000 -range 256M -target_address_space [get_bd_addr_spaces xdma_0/M_AXI] [get_bd_addr_segs hbm_0/SAXI_29/HBM_MEM29]
assign_bd_address -offset 0x00000001E0000000 -range 256M -target_address_space [get_bd_addr_spaces xdma_0/M_AXI] [get_bd_addr_segs hbm_0/SAXI_30/HBM_MEM30]
assign_bd_address -offset 0x00000001F0000000 -range 256M -target_address_space [get_bd_addr_spaces xdma_0/M_AXI] [get_bd_addr_segs hbm_0/SAXI_31/HBM_MEM31]

validate_bd_design
save_bd_design
